# Altium schematic sheet T1_Data_Top_Level.SchDoc
size 431 x 279 mm; Date: Not shown in title block; ApprovedBy: Not shown in title block; CheckedBy: Not shown in title block; Author: Not shown in title block; CompanyName: Not shown in title block; DrawnBy: Andy Lin (TI); Engineer: Not shown in title block; Organization: Not shown in title block; Address1: Not shown in title block; Address2: Not shown in title block; Address3: Not shown in title block; Address4: Not shown in title block; DocumentNumber: 12; Revision: Use project parameter SCH_Rev; SheetNumber: 12; SheetTotal: 14; PageSetup: Record=PageOptions|CenterHorizontal=True|CenterVertical=True|PrintScale=1.00|XCorrection=1.00|YCorrection=1.00|PrintKind=0|BorderSize=5000000|LeftOffset=0|BottomOffset=0|Orientation=2|PaperLength=1000|PaperWidth=1000|Scale=100|PaperSource=15|PrintQuality=600|MediaType=1|DitherType=10|PaperKind=Letter|PrintScaleMode=1; CurrentTime: Not shown in title block; CurrentDate: Not shown in title block; Time: Not shown in title block; DocumentFullPathAndName: Not shown in title block; DocumentName: Not shown in title block; ModifiedDate: Not shown in title block; ImagePath: Not shown in title block
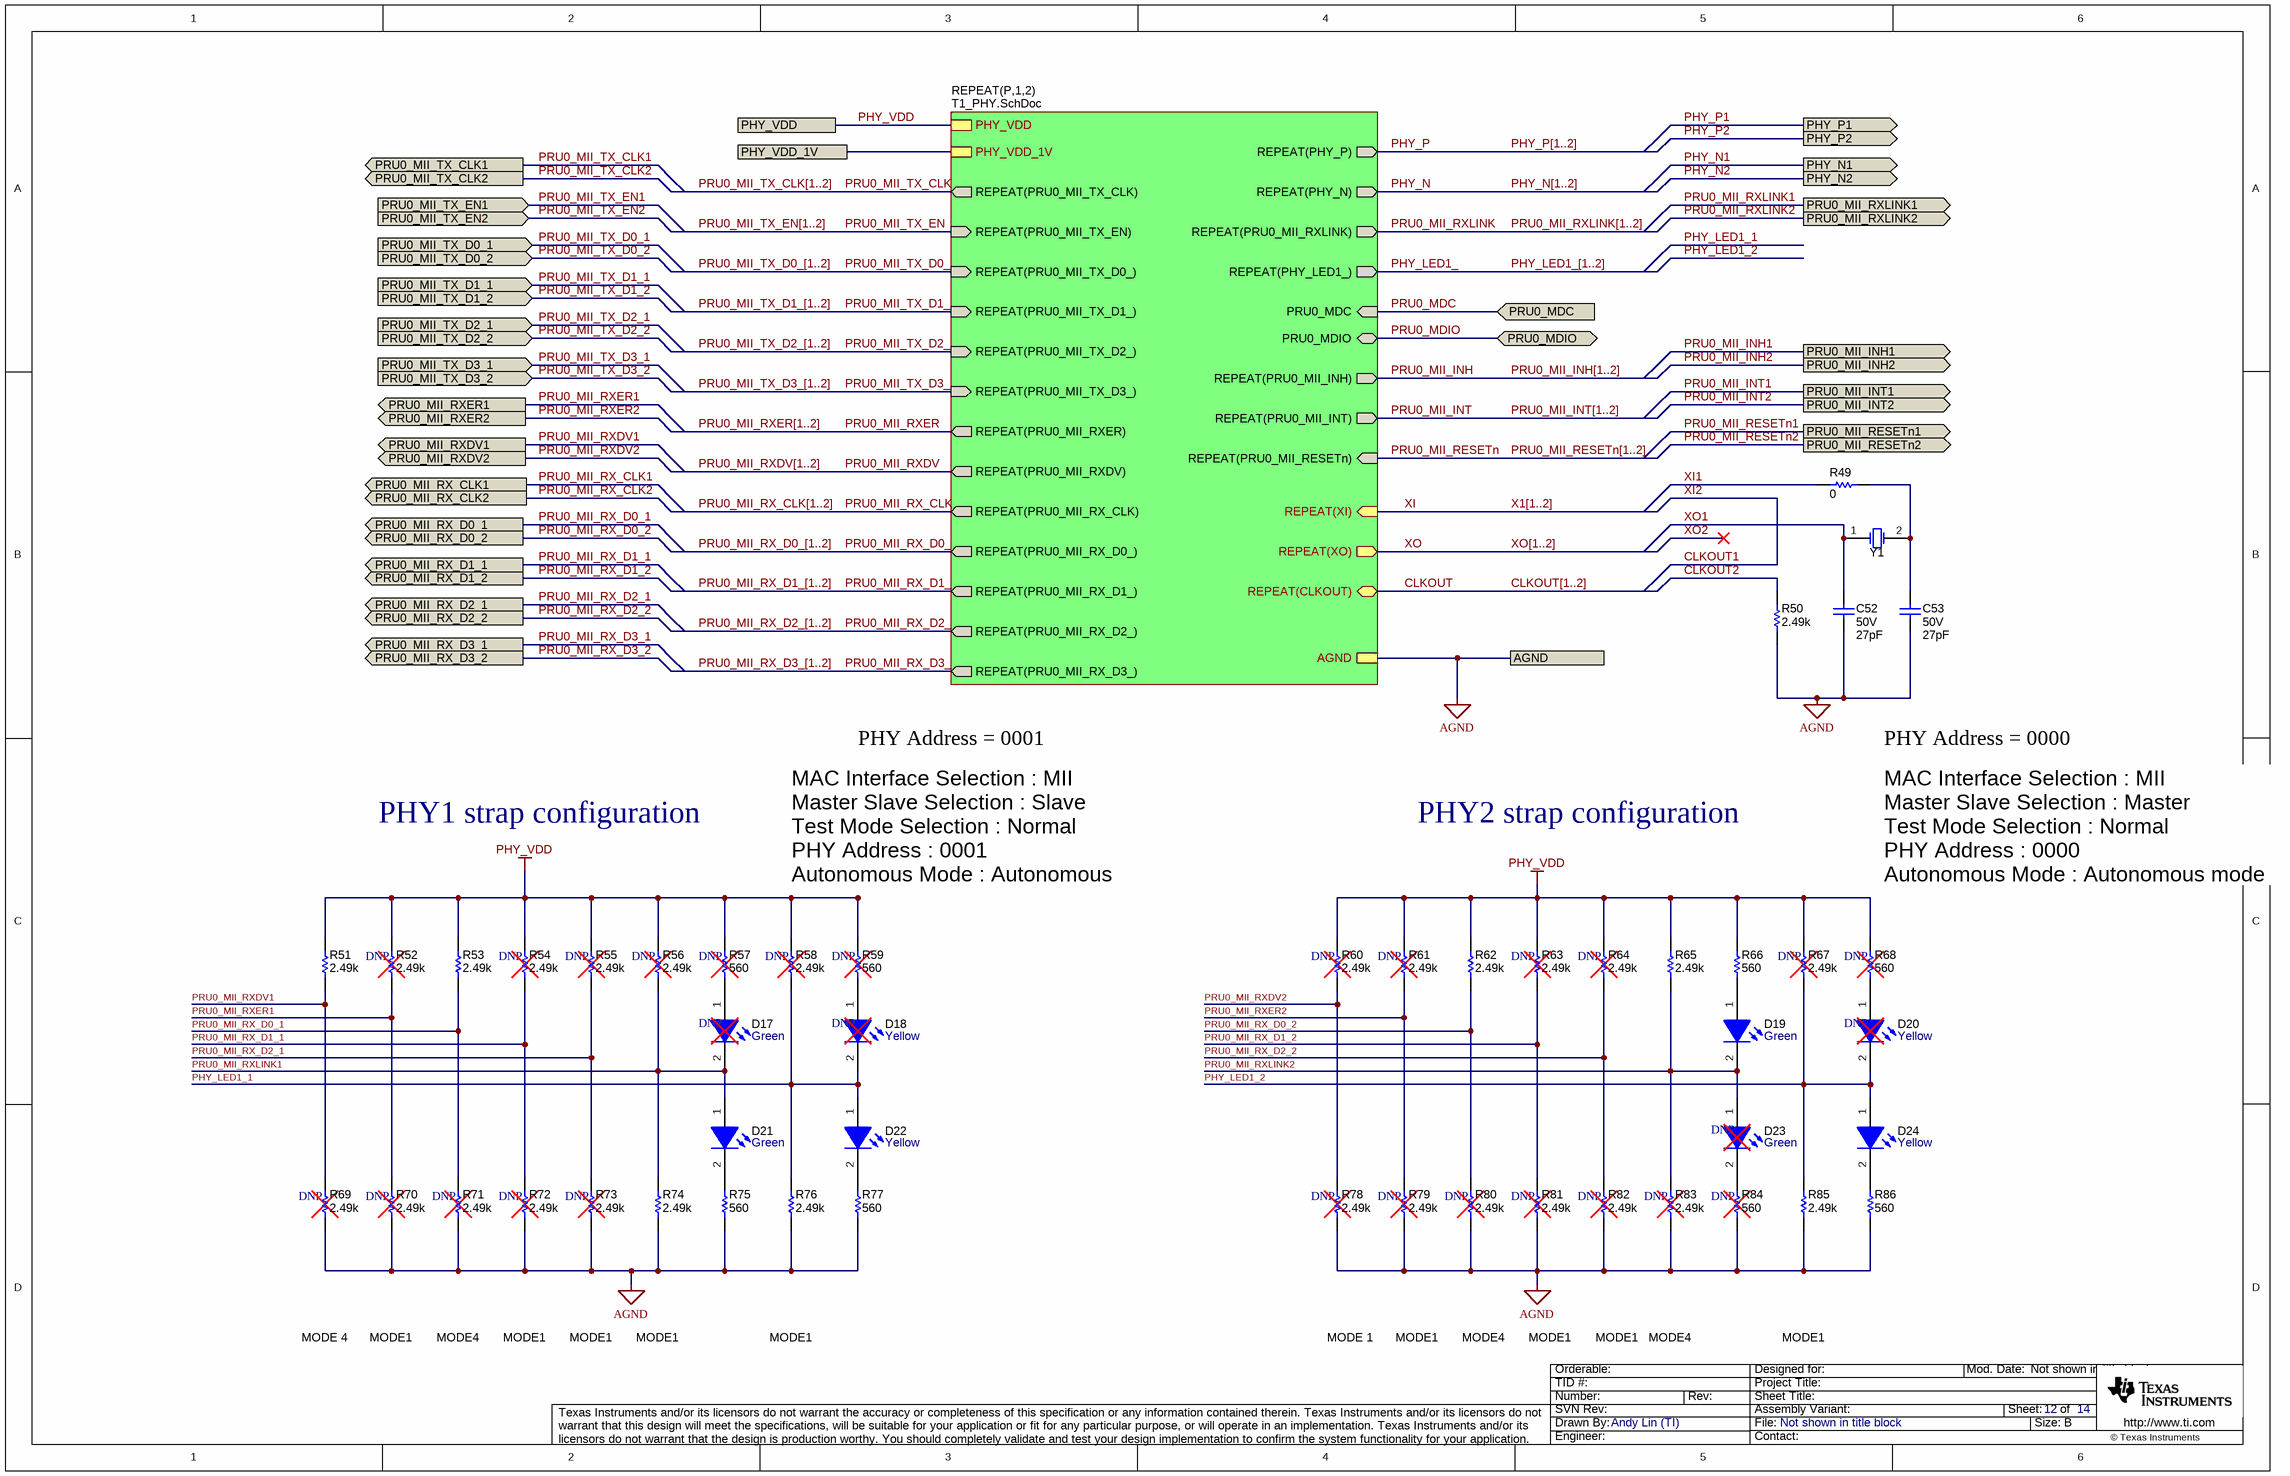
[diagram p0: T1_Data_Top_Level.SchDoc]

## Parts
C52  VDC_V: 50V  ValueDisplayed: 27pF  [0603]  (hidden comment: GRM1885C1H270JA01D)
C53  VDC_V: 50V  ValueDisplayed: 27pF  [0603]  (hidden comment: GRM1885C1H270JA01D)
D17  value Green  [LG L29K_GREEN]  (hidden comment: LG L29K-G2J1-24-Z)
D18  value Yellow  [LY L29K_Yellow]  (hidden comment: LY L29K-J1K2-26-Z)
D19  value Green  [LG L29K_GREEN]  (hidden comment: LG L29K-G2J1-24-Z)
D20  value Yellow  [LY L29K_Yellow]  (hidden comment: LY L29K-J1K2-26-Z)
D21  value Green  [LG L29K_GREEN]  (hidden comment: LG L29K-G2J1-24-Z)
D22  value Yellow  [LY L29K_Yellow]  (hidden comment: LY L29K-J1K2-26-Z)
D23  value Green  [LG L29K_GREEN]  (hidden comment: LG L29K-G2J1-24-Z)
D24  value Yellow  [LY L29K_Yellow]  (hidden comment: LY L29K-J1K2-26-Z)
R49  ValueDisplayed: 0  [0402]  (hidden comment: CRCW04020000Z0ED)
R50  ValueDisplayed: 2.49k  [0402]  (hidden comment: CRCW04022K49FKED)
R51  ValueDisplayed: 2.49k  [0402]  (hidden comment: CRCW04022K49FKED)
R52  ValueDisplayed: 2.49k  [0402]  (hidden comment: CRCW04022K49FKED)
R53  ValueDisplayed: 2.49k  [0402]  (hidden comment: CRCW04022K49FKED)
R54  ValueDisplayed: 2.49k  [0402]  (hidden comment: CRCW04022K49FKED)
R55  ValueDisplayed: 2.49k  [0402]  (hidden comment: CRCW04022K49FKED)
R56  ValueDisplayed: 2.49k  [0402]  (hidden comment: CRCW04022K49FKED)
R57  ValueDisplayed: 560  [0402]  (hidden comment: CRCW0402560RJNED)
R58  ValueDisplayed: 2.49k  [0402]  (hidden comment: CRCW04022K49FKED)
R59  ValueDisplayed: 560  [0402]  (hidden comment: CRCW0402560RJNED)
R60  ValueDisplayed: 2.49k  [0402]  (hidden comment: CRCW04022K49FKED)
R61  ValueDisplayed: 2.49k  [0402]  (hidden comment: CRCW04022K49FKED)
R62  ValueDisplayed: 2.49k  [0402]  (hidden comment: CRCW04022K49FKED)
R63  ValueDisplayed: 2.49k  [0402]  (hidden comment: CRCW04022K49FKED)
R64  ValueDisplayed: 2.49k  [0402]  (hidden comment: CRCW04022K49FKED)
R65  ValueDisplayed: 2.49k  [0402]  (hidden comment: CRCW04022K49FKED)
R66  ValueDisplayed: 560  [0402]  (hidden comment: CRCW0402560RJNED)
R67  ValueDisplayed: 2.49k  [0402]  (hidden comment: CRCW04022K49FKED)
R68  ValueDisplayed: 560  [0402]  (hidden comment: CRCW0402560RJNED)
R69  ValueDisplayed: 2.49k  [0402]  (hidden comment: CRCW04022K49FKED)
R70  ValueDisplayed: 2.49k  [0402]  (hidden comment: CRCW04022K49FKED)
R71  ValueDisplayed: 2.49k  [0402]  (hidden comment: CRCW04022K49FKED)
R72  ValueDisplayed: 2.49k  [0402]  (hidden comment: CRCW04022K49FKED)
R73  ValueDisplayed: 2.49k  [0402]  (hidden comment: CRCW04022K49FKED)
R74  ValueDisplayed: 2.49k  [0402]  (hidden comment: CRCW04022K49FKED)
R75  ValueDisplayed: 560  [0402]  (hidden comment: CRCW0402560RJNED)
R76  ValueDisplayed: 2.49k  [0402]  (hidden comment: CRCW04022K49FKED)
R77  ValueDisplayed: 560  [0402]  (hidden comment: CRCW0402560RJNED)
R78  ValueDisplayed: 2.49k  [0402]  (hidden comment: CRCW04022K49FKED)
R79  ValueDisplayed: 2.49k  [0402]  (hidden comment: CRCW04022K49FKED)
R80  ValueDisplayed: 2.49k  [0402]  (hidden comment: CRCW04022K49FKED)
R81  ValueDisplayed: 2.49k  [0402]  (hidden comment: CRCW04022K49FKED)
R82  ValueDisplayed: 2.49k  [0402]  (hidden comment: CRCW04022K49FKED)
R83  ValueDisplayed: 2.49k  [0402]  (hidden comment: CRCW04022K49FKED)
R84  ValueDisplayed: 560  [0402]  (hidden comment: CRCW0402560RJNED)
R85  ValueDisplayed: 2.49k  [0402]  (hidden comment: CRCW04022K49FKED)
R86  ValueDisplayed: 560  [0402]  (hidden comment: CRCW0402560RJNED)
Y1  ABM3-25.000MHZ-D2Y-T  [XTAL_ABM3]  (value not drawn)

## Sub-sheets
REPEAT(P,1,2) = T1_PHY.SchDoc: REPEAT(PRU0_MII_INH) (out), REPEAT(PRU0_MII_INT) (out), REPEAT(PRU0_MII_RESETn) (in), REPEAT(PRU0_MII_TX_CLK) (out), REPEAT(PRU0_MII_TX_EN) (in), REPEAT(PRU0_MII_TX_D0_) (in), REPEAT(PRU0_MII_TX_D1_) (in), REPEAT(PRU0_MII_TX_D2_) (in), REPEAT(PRU0_MII_TX_D3_) (in), REPEAT(PRU0_MII_RX_D0_) (out), REPEAT(PRU0_MII_RX_D1_) (out), REPEAT(PRU0_MII_RX_D2_) (out), REPEAT(PRU0_MII_RX_D3_) (out), REPEAT(PRU0_MII_RXER) (out), REPEAT(PRU0_MII_RXDV) (out), REPEAT(PRU0_MII_RX_CLK) (out), REPEAT(PRU0_MII_RXLINK) (out), PRU0_MDIO (bidir), PRU0_MDC (in), REPEAT(PHY_P) (out), REPEAT(PHY_N) (out), REPEAT(PHY_LED1_) (out), AGND, PHY_VDD, REPEAT(XO) (out), REPEAT(XI) (in), REPEAT(CLKOUT) (bidir), PHY_VDD_1V

## Ports
AGND, PHY_N1 (out), PHY_N2 (out), PHY_P1 (out), PHY_P2 (out), PHY_VDD, PHY_VDD_1V, PRU0_MDC (in), PRU0_MDIO (bidir), PRU0_MII_INH1 (out), PRU0_MII_INH2 (out), PRU0_MII_INT1 (out), PRU0_MII_INT2 (out), PRU0_MII_RESETn1 (out), PRU0_MII_RESETn2 (out), PRU0_MII_RX_CLK1 (out), PRU0_MII_RX_CLK2 (out), PRU0_MII_RX_D0_1 (out), PRU0_MII_RX_D0_2 (out), PRU0_MII_RX_D1_1 (out), PRU0_MII_RX_D1_2 (out), PRU0_MII_RX_D2_1 (out), PRU0_MII_RX_D2_2 (out), PRU0_MII_RX_D3_1 (out), PRU0_MII_RX_D3_2 (out), PRU0_MII_RXDV1 (out), PRU0_MII_RXDV2 (out), PRU0_MII_RXER1 (out), PRU0_MII_RXER2 (out), PRU0_MII_RXLINK1 (out), PRU0_MII_RXLINK2 (out), PRU0_MII_TX_CLK1 (out), PRU0_MII_TX_CLK2 (out), PRU0_MII_TX_D0_1 (in), PRU0_MII_TX_D0_2 (in), PRU0_MII_TX_D1_1 (in), PRU0_MII_TX_D1_2 (in), PRU0_MII_TX_D2_1 (in), PRU0_MII_TX_D2_2 (in), PRU0_MII_TX_D3_1 (in), PRU0_MII_TX_D3_2 (in), PRU0_MII_TX_EN1 (in), PRU0_MII_TX_EN2 (in)

## Nets
AGND: C52.2 C53.2 R50.1 R69.1 R70.1 R71.1 R72.1 R73.1 R74.1 R75.1 R76.1 R77.1 R78.1 R79.1 R80.1 R81.1 R82.1 R83.1 R84.1 R85.1 R86.1 ; port AGND, sheet REPEAT(P,1,2)/AGND
PHY_VDD: R51.2 R52.2 R53.2 R54.2 R55.2 R56.2 R57.2 R58.2 R59.2 R60.2 R61.2 R62.2 R63.2 R64.2 R65.2 R66.2 R67.2 R68.2 ; port PHY_VDD, sheet REPEAT(P,1,2)/PHY_VDD
CLKOUT: sheet REPEAT(P,1,2)/REPEAT(CLKOUT)
CLKOUT2: R50.2
PHY_LED1_: sheet REPEAT(P,1,2)/REPEAT(PHY_LED1_)
PHY_LED1_1: D18.2(K) D22.1(A) R58.1 R76.2
PHY_LED1_2: D20.2(K) D24.1(A) R67.1 R85.2
PHY_N: sheet REPEAT(P,1,2)/REPEAT(PHY_N)
PHY_N1: port PHY_N1
PHY_N2: port PHY_N2
PHY_P: sheet REPEAT(P,1,2)/REPEAT(PHY_P)
PHY_P1: port PHY_P1
PHY_P2: port PHY_P2
PHY_VDD_1V: port PHY_VDD_1V, sheet REPEAT(P,1,2)/PHY_VDD_1V
PRU0_MDC: port PRU0_MDC, sheet REPEAT(P,1,2)/PRU0_MDC
PRU0_MDIO: port PRU0_MDIO, sheet REPEAT(P,1,2)/PRU0_MDIO
PRU0_MII_INH: sheet REPEAT(P,1,2)/REPEAT(PRU0_MII_INH)
PRU0_MII_INH1: port PRU0_MII_INH1
PRU0_MII_INH2: port PRU0_MII_INH2
PRU0_MII_INT: sheet REPEAT(P,1,2)/REPEAT(PRU0_MII_INT)
PRU0_MII_INT1: port PRU0_MII_INT1
PRU0_MII_INT2: port PRU0_MII_INT2
PRU0_MII_RESETn: sheet REPEAT(P,1,2)/REPEAT(PRU0_MII_RESETn)
PRU0_MII_RESETn1: port PRU0_MII_RESETn1
PRU0_MII_RESETn2: port PRU0_MII_RESETn2
PRU0_MII_RX_CLK: sheet REPEAT(P,1,2)/REPEAT(PRU0_MII_RX_CLK)
PRU0_MII_RX_CLK1: port PRU0_MII_RX_CLK1
PRU0_MII_RX_CLK2: port PRU0_MII_RX_CLK2
PRU0_MII_RX_D0_: sheet REPEAT(P,1,2)/REPEAT(PRU0_MII_RX_D0_)
PRU0_MII_RX_D0_1: R53.1 R71.2 ; port PRU0_MII_RX_D0_1
PRU0_MII_RX_D0_2: R62.1 R80.2 ; port PRU0_MII_RX_D0_2
PRU0_MII_RX_D1_: sheet REPEAT(P,1,2)/REPEAT(PRU0_MII_RX_D1_)
PRU0_MII_RX_D1_1: R54.1 R72.2 ; port PRU0_MII_RX_D1_1
PRU0_MII_RX_D1_2: R63.1 R81.2 ; port PRU0_MII_RX_D1_2
PRU0_MII_RX_D2_: sheet REPEAT(P,1,2)/REPEAT(PRU0_MII_RX_D2_)
PRU0_MII_RX_D2_1: R55.1 R73.2 ; port PRU0_MII_RX_D2_1
PRU0_MII_RX_D2_2: R64.1 R82.2 ; port PRU0_MII_RX_D2_2
PRU0_MII_RX_D3_: sheet REPEAT(P,1,2)/REPEAT(PRU0_MII_RX_D3_)
PRU0_MII_RX_D3_1: port PRU0_MII_RX_D3_1
PRU0_MII_RX_D3_2: port PRU0_MII_RX_D3_2
PRU0_MII_RXDV: sheet REPEAT(P,1,2)/REPEAT(PRU0_MII_RXDV)
PRU0_MII_RXDV1: R51.1 R69.2 ; port PRU0_MII_RXDV1
PRU0_MII_RXDV2: R60.1 R78.2 ; port PRU0_MII_RXDV2
PRU0_MII_RXER: sheet REPEAT(P,1,2)/REPEAT(PRU0_MII_RXER)
PRU0_MII_RXER1: R52.1 R70.2 ; port PRU0_MII_RXER1
PRU0_MII_RXER2: R61.1 R79.2 ; port PRU0_MII_RXER2
PRU0_MII_RXLINK: sheet REPEAT(P,1,2)/REPEAT(PRU0_MII_RXLINK)
PRU0_MII_RXLINK1: D17.2(K) D21.1(A) R56.1 R74.2 ; port PRU0_MII_RXLINK1
PRU0_MII_RXLINK2: D19.2(K) D23.1(A) R65.1 R83.2 ; port PRU0_MII_RXLINK2
PRU0_MII_TX_CLK: sheet REPEAT(P,1,2)/REPEAT(PRU0_MII_TX_CLK)
PRU0_MII_TX_CLK1: port PRU0_MII_TX_CLK1
PRU0_MII_TX_CLK2: port PRU0_MII_TX_CLK2
PRU0_MII_TX_D0_: sheet REPEAT(P,1,2)/REPEAT(PRU0_MII_TX_D0_)
PRU0_MII_TX_D0_1: port PRU0_MII_TX_D0_1
PRU0_MII_TX_D0_2: port PRU0_MII_TX_D0_2
PRU0_MII_TX_D1_: sheet REPEAT(P,1,2)/REPEAT(PRU0_MII_TX_D1_)
PRU0_MII_TX_D1_1: port PRU0_MII_TX_D1_1
PRU0_MII_TX_D1_2: port PRU0_MII_TX_D1_2
PRU0_MII_TX_D2_: sheet REPEAT(P,1,2)/REPEAT(PRU0_MII_TX_D2_)
PRU0_MII_TX_D2_1: port PRU0_MII_TX_D2_1
PRU0_MII_TX_D2_2: port PRU0_MII_TX_D2_2
PRU0_MII_TX_D3_: sheet REPEAT(P,1,2)/REPEAT(PRU0_MII_TX_D3_)
PRU0_MII_TX_D3_1: port PRU0_MII_TX_D3_1
PRU0_MII_TX_D3_2: port PRU0_MII_TX_D3_2
PRU0_MII_TX_EN: sheet REPEAT(P,1,2)/REPEAT(PRU0_MII_TX_EN)
PRU0_MII_TX_EN1: port PRU0_MII_TX_EN1
PRU0_MII_TX_EN2: port PRU0_MII_TX_EN2
XI: sheet REPEAT(P,1,2)/REPEAT(XI)
XI1: R49.1
XO: sheet REPEAT(P,1,2)/REPEAT(XO)
XO1: C52.1 Y1.1(OSC1)
NetC53_1: C53.1 R49.2 Y1.2(OSC2)
NetD17_1: D17.1(A) R57.1
NetD18_1: D18.1(A) R59.1
NetD19_1: D19.1(A) R66.1
NetD20_1: D20.1(A) R68.1
NetD21_2: D21.2(K) R75.2
NetD22_2: D22.2(K) R77.2
NetD23_2: D23.2(K) R84.2
NetD24_2: D24.2(K) R86.2

## Buses and harness runs
bus CLKOUT[1..2]
bus PHY_LED1_[1..2]
bus PHY_N[1..2]
bus PHY_P[1..2]
bus PRU0_MII_INH[1..2]
bus PRU0_MII_INT[1..2]
bus PRU0_MII_RESETn[1..2]
bus PRU0_MII_RX_CLK[1..2]
bus PRU0_MII_RX_D0_[1..2]
bus PRU0_MII_RX_D1_[1..2]
bus PRU0_MII_RX_D2_[1..2]
bus PRU0_MII_RX_D3_[1..2]
bus PRU0_MII_RXDV[1..2]
bus PRU0_MII_RXER[1..2]
bus PRU0_MII_RXLINK[1..2]
bus PRU0_MII_TX_CLK[1..2]
bus PRU0_MII_TX_D0_[1..2]
bus PRU0_MII_TX_D1_[1..2]
bus PRU0_MII_TX_D2_[1..2]
bus PRU0_MII_TX_D3_[1..2]
bus PRU0_MII_TX_EN[1..2]
bus X1[1..2]
bus XO[1..2]

## Notes on the sheet
- PHY1 strap configuration
- PHY2 strap configuration
- MAC Interface Selection : MII
  Master Slave Selection : Slave
  Test Mode Selection : Normal
  PHY Address : 0001
  Autonomous Mode : Autonomous mode
- MAC Interface Selection : MII
  Master Slave Selection : Master
  Test Mode Selection : Normal
  PHY Address : 0000
  Autonomous Mode : Autonomous mode
- (near R52) DNP
- (near R54) DNP
- (near R55) DNP
- (near R56) DNP
- (near R57) DNP
- (near R58) DNP
- (near R59) DNP
- (near R60) DNP
- (near R61) DNP
- (near R63) DNP
- (near R64) DNP
- (near R67) DNP
- (near R68) DNP
- (near D17) DNP
- (near D18) DNP
- (near D20) DNP
- (near D23) DNP
- (near R69) DNP
- (near R70) DNP
- (near R71) DNP
- (near R72) DNP
- (near R73) DNP
- (near R78) DNP
- (near R79) DNP
- (near R80) DNP
- (near R81) DNP
- (near R82) DNP
- (near R83) DNP
- (near R84) DNP
- MODE 4
- MODE1
- MODE4
- MODE 1
- Labels drawn without touching a wire or pin: PHY Address = 0000, PHY Address = 0001
- Drawn By:
- SVN Rev:
- Number:
- TID #:
- Orderable:
- Rev:
- Sheet Title:
- File:
- Project Title:
- Designed for:
- Assembly Variant:
- Mod. Date:
- Sheet:
- Size:
- of
- B
- http://www.ti.com
- Texas Instruments and/or its licensors do not warrant the accuracy or completeness of this specification or any information contained therein. Texas Instruments and/or its licensors do not warrant that this design will meet the specifications, will be suitable for your application or fit for any particular purpose, or will operate in an implementation. Texas Instruments and/or its licensors do not warrant that the design is production worthy. You should completely validate and test your design implementation to confirm the system functionality for your application.
- Engineer:
- Contact:
- © Texas Instruments

## Library data of the parts
C52 C53 = CMP-0007202-4: CAP, CERM, 27 pF, 50 V, +/- 5%, C0G/NP0, 0603; Manufacturer: MuRata; TaMin_C: -55°C; Polarized: N; SizeAreaWB_mm2: 4.68; Value1: Unknown; U/M: EA; Value: 27pF; TaMax_C: 125°C; SizeZ_mm: 1; SizeX_mm: 1.6; SizeY_mm: 0.8; SizeArea_mm2: 1.28; AEC Category: Q200; Supplier Part Number 2: 81-GRM1885C1H270JA01; Publisher: Texas Instruments; Supplier 2: Mouser; Supplier Part Number 3: 1828909; TempCo: C0G/NP0; Supplier 3: Farnell; Published: 2008-06-19; RoHS: Y; MountType: SMT; Supplier 1: Digi-Key; PackageReference: 0603; Tolerance_%: 5%; Cap_Case: 0603; Value2: 50V; CompType: Capacitor; LatestRevisionDate: 2017-03-09; PartNumber: GRM1885C1H270JA01D; AEC Qualified: ?; Cap_F: 27pF; ComponentLink1Description: Datasheet link; Supplier Part Number 1: 490-1413-1-ND; Technology: Ceramic; ComponentLink1URL: http://search.murata.co.jp/Ceramy/PnsearchViewAction.do?HnOFG=ON&HnNFG=ON&SEL_CNT=50&sLang=en&sKey=GRM1885C1H270JA01D&x=9&y=9&search=startwith
D17 D19 D21 D23 = CMP-0002874-2: LED, Green, SMD; Manufacturer: OSRAM; Io_A: 2mA; Value2: 1.7V; Value1: W; Tjmax_C: 110°C; RoHS: Y; PartNumber: LG L29K-G2J1-24-Z; Color: green; Type: ?; PackageReference: 1.7x0.65x0.8mm; ComponentLink1URL: http://www.osram-os.com/Graphics/XPic2/00077107_0.pdf; ComponentLink1Description: Datasheet link; Vf_V: 1.7V; CompType: LED; MountType: SMT
D18 D20 D22 D24 = CMP-0002875-2: LED, Yellow, SMD; Manufacturer: OSRAM; Tjmax_C: 110°C; Value1: W; Value2: 1.8V; Io_A: 2mA; RoHS: Y; PackageReference: LED, 1.3x0.65x0.8mm; ComponentLink1URL: http://www.osram-os.com/Graphics/XPic1/00077106_0.pdf/LY%20%20%20%20%20%20L29K%20-%20SMARTLED%200603.pdf; CompType: LED; PartNumber: LY L29K-J1K2-26-Z; Color: yellow; Type: ?; Vf_V: 1.8V; ComponentLink1Description: Datasheet link; MountType: SMT
R49 = CMP-0026822-2: RES, 0, 5%, 0.063 W, 0402; Manufacturer: Vishay-Dale; Power_W: 63mW; TempCo: 200 ppm/C; Value_Code: 0000; U/M: EA; Value: 0; EIA_Code: E24; SizeX_mm: 1; SizeY_mm: 0.5; SizeZ_mm: 0.6; Value2: 0.063W; VDC_V: 50V; AEC Category: Q200; Supplier Part Number 2: 52K6543; Publisher: Texas Instruments; Supplier 2: Newark; Supplier Part Number 3: 71-CRCW0402-0-E3; Supplier 3: Mouser; Published: 2008-06-26; RoHS: Y; Value1: 5%; MountType: SMT; Supplier 1: Digi-Key; PackageReference: 0402; Tolerance_%: 5%; Res_ohm: 0; SizeArea_mm2: 0.5; CompType: Resistor; LatestRevisionDate: 2017-03-09; PartNumber: CRCW04020000Z0ED; AEC Qualified: ?; ComponentLink1Description: Datasheet link; Supplier Part Number 1: 541-0.0JCT-ND; Technology: Thick Film; ComponentLink1URL: http://www.vishay.com/docs/20035/dcrcwe3.pdf
R50-R56 R58 R60-R65 R67 R69-R74 R76 R78-R83 R85 = CMP-0026237-2: RES, 2.49 k, 1%, 0.063 W, AEC-Q200 Grade 0, 0402; Manufacturer: Vishay-Dale; Power_W: 63mW; TempCo: 100 ppm/C; Value_Code: 2k49; Value: 2.49k; EIA_Code: E96; SizeX_mm: 1; SizeY_mm: 0.5; SizeZ_mm: 0.6; Value2: 0.063W; AEC Qualified: Y; VDC_V: 50V; AEC Category: Q200; AEC Grade: 0; ComponentLink1URL: http://www.vishay.com/docs/20035/dcrcwe3.pdf; Supplier Part Number 2: 52K6803; Supplier 2: Newark; Supplier Part Number 3: 71-CRCW0402-2.49K-E3; Supplier 3: Mouser; RoHS: E; Value1: 1%; MountType: SMT; Supplier 1: Digi-Key; PackageReference: 0402; Tolerance_%: 1%; Res_ohm: 2.49k; SizeArea_mm2: 0.5; CompType: Resistor; PartNumber: CRCW04022K49FKED; ComponentLink1Description: Datasheet link; Supplier Part Number 1: 541-2.49KLCT-ND; Technology: Thick Film
R57 R59 R66 R68 R75 R77 R84 R86 = CMP-0026948-3: RES, 560, 5%, 0.063 W, AEC-Q200 Grade 0, 0402; Manufacturer: Vishay-Dale; Power_W: 63mW; TempCo: 200 ppm/C; Value_Code: 560R; Value: 560; EIA_Code: E24; SizeX_mm: 1; SizeY_mm: 0.5; SizeZ_mm: 0.6; Value2: 0.063W; AEC Qualified: Y; VDC_V: 50V; AEC Category: Q200; AEC Grade: 0; Supplier Part Number 2: 59M6740; Supplier 2: Newark; Supplier Part Number 3: 71-CRCW0402J-560-E3; Supplier 3: Mouser; RoHS: E; Value1: 5%; MountType: SMT; Supplier 1: Digi-Key; PackageReference: 0402; Tolerance_%: 5%; Res_ohm: 560; SizeArea_mm2: 0.5; CompType: Resistor; PartNumber: CRCW0402560RJNED; ComponentLink1Description: Datasheet link; Supplier Part Number 1: 541-560JCT-ND; Technology: Thick Film; ComponentLink1URL: http://www.vishay.com/docs/20035/dcrcwe3.pdf
Y1 = CMP-0004620-3: Crystal, 25 MHz, 18 pF, SMD; Manufacturer: Abracon Corporation; TaMin_C: -40°C; Frequency Stability: +/-30ppm; Frequency_Fixed: 25MHz; TaMax_C: 85°C; Supplier Part Number 2: 77R1477; Supplier 2: Newark; Supplier Part Number 3: 815-ABM3-25-D2Y-T; Supplier 3: Mouser; RoHS: E; MountType: SMT; Supplier 1: Digi-Key; PackageReference: ABM3; CompType: Crystal; PartNumber: ABM3-25.000MHZ-D2Y-T; ComponentLink1Description: Datasheet Link; Supplier Part Number 1: 535-10645-1-ND; ComponentLink1URL: http://www.abracon.com/Resonators/abm3.pdf; REACh: Y